# Altium schematic sheet BreakResistor.SchDoc
size A4; SheetNumber: 3; SheetTotal: 5
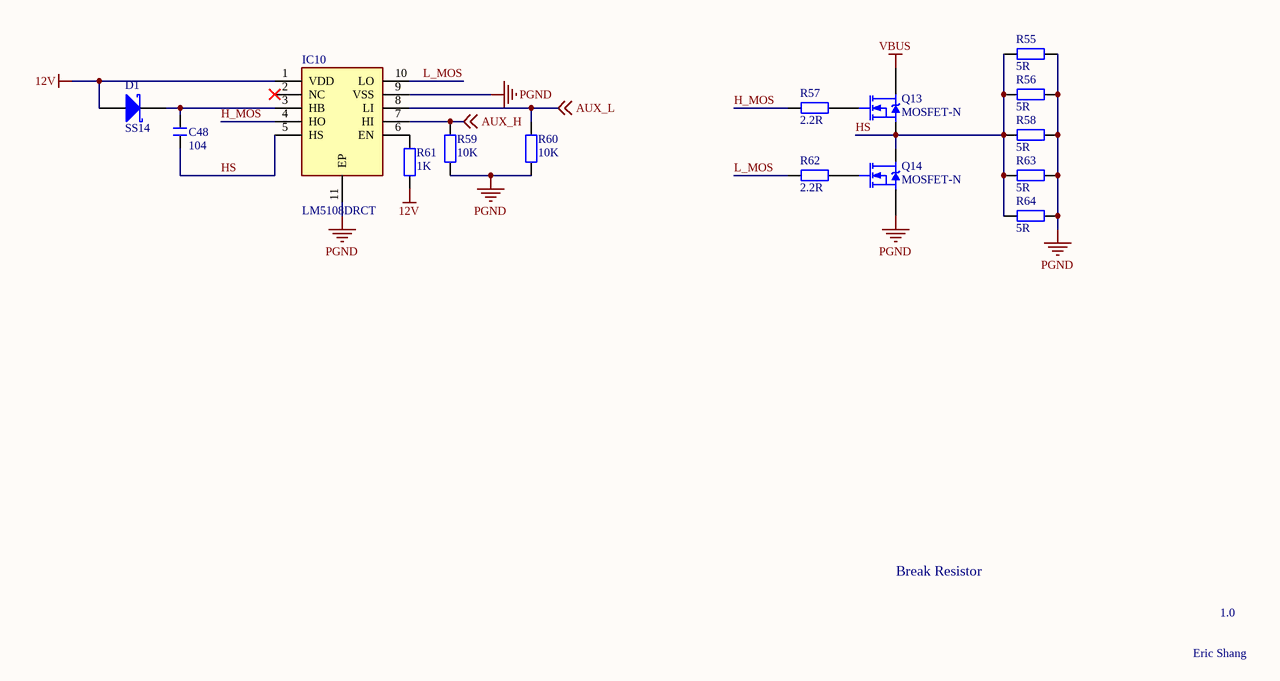
[diagram p0: BreakResistor.SchDoc]

## Parts
C48  104  [C 0603_L]
D1  SS14  [SMA]
IC10  LM5108DRCT  [SON50P300X300X100-11N-D]
Q13  MOSFET-N  [TO263-3B]
Q14  MOSFET-N  [TO263-3B]
R55  5R  [RX10-18*15*5]
R56  5R  [RX10-18*15*5]
R57  2.2R  [R 0603_L]
R58  5R  [RX10-18*15*5]
R59  10K  [R 0603_L]
R60  10K  [R 0603_L]
R61  1K  [R 0603_L]
R62  2.2R  [R 0603_L]
R63  5R  [RX10-18*15*5]
R64  5R  [RX10-18*15*5]

## Nets
12V: D1.1(A) IC10.1(VDD) R61.2
PGND: IC10.9(VSS) IC10.11(EP) Q14.3(S) R55.2 R56.2 R58.2 R59.2 R60.2 R63.2 R64.2
VBUS: Q13.2(D)
AUX_H: IC10.7(HI) R59.1 ; off-sheet AUX_H
AUX_L: IC10.8(LI) R60.1 ; off-sheet AUX_L
H_MOS: IC10.4(HO) R57.1
HS: C48.1 IC10.5(HS) Q13.3(S) Q14.2(D) R55.1 R56.1 R58.1 R63.1 R64.1
L_MOS: IC10.10(LO) R62.1
NetC48_2: C48.2 D1.2(K) IC10.3(HB)
NetIC10_6: IC10.6(EN) R61.1
NetQ13_1: Q13.1(G) R57.2
NetQ14_1: Q14.1(G) R62.2

Not connected (* = marked no-connect by the designer): IC10 2(NC)*

## Notes on the sheet
- Break Resistor
- 1.0
- Eric Shang

## Library data of the parts
C48 = C: 贴片电容; BOM名称: 无极性贴片电容; 淘宝ID: 封装库来自淘宝 ID：黄晶宝石; 联系售后，技术支持: https://shop463601444.taobao.com; 唯一出售店铺网址: https://shop463601444.taobao.com
D1 = SS14: 肖特基二极管; 属性: 40V/1A; BOM名称: 肖特基二极管; 封装库来自淘宝 ID：黄晶宝石: https://shop463601444.taobao.com
IC10 = LM5108DRCT: Integrated Circuit; Manufacturer_Name: Texas Instruments; Datasheet Link: http://www.ti.com/lit/gpn/LM5108; Height: 1mm; Manufacturer_Part_Number: LM5108DRCT; Mouser Part Number: 595-LM5108DRCT; Mouser Price/Stock: https://www.mouser.co.uk/ProductDetail/Texas-Instruments/LM5108DRCT?qs=T3oQrply3y%2FzIxTRQrXrXQ%3D%3D; Arrow Part Number: LM5108DRCT; Arrow Price/Stock: https://www.arrow.com/en/products/lm5108drct/texas-instruments?region=nac
Q13 Q14 = MOSFET-N: N-Channel MOSFET; PackageDocument: 1995/1996; Published: 8-Jun-2000; LatestRevisionDate: 17-Jul-2002; LatestRevisionNote: Re-released for DXP Platform.; PackageReference: E3; Publisher: Altium Limited
R55 R56 R58 R63 R64 = R_MPR: 5W无感水泥电阻; BOM名称: 大功率电阻; 版权归属: 封装库来自淘宝 ID：黄晶宝石; 联系售后: https://shop463601444.taobao.com
R57 R59-R62 = R: 贴片电阻; 版权归属: 来自淘宝 ID：黄晶宝石; 封装库来自淘宝卖家 ID：黄晶宝石: 其他店铺购入均为盗版，不享受售后技术支持服务，请立即申请退款; BOM名称: 贴片电阻; 联系售后: https://shop463601444.taobao.com